# EAGLE schematic Gelijkrichter (EAGLE 9.2.0)
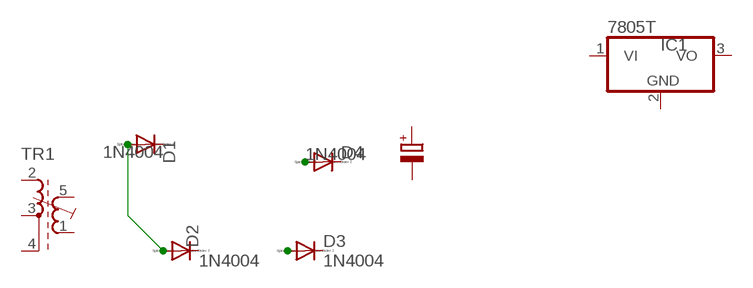
[diagram p0: schematic, sheet 1]

## Parts
D1  1N4004  [DO41-10]
D2  1N4004  [DO41-10]
D3  1N4004  [DO41-10]
D4  1N4004  [DO41-10]
IC1  7805T  [TO220H]
TR1  71-24513-2  [71-5]

## Nets
N$1: D1.A D2.A
N$3: D3.A
N$4: D4.A
Unconnected: D1.C D2.C D3.C D4.C IC1.1(VI) IC1.2(GND) IC1.3(VO) TR1.1(E2) TR1.2(A1) TR1.3(Z) TR1.4(E1) TR1.5(A2) TR1.S1 TR1.S2

## Library data of the parts
D1-D4 = diode:1N4004: DIODE general purpose rectifier, 1 A
IC1 = linear:78*: Positive VOLTAGE REGULATOR Source: http://cache.national.com/ds/LM/LM78L05.pdf http://www.fairchildsemi.com/ds/LM/LM7805.pdf
TR1 = inductor-neosid:71-: RF TRANSFORMER adjustable RF coil/transformer; OC_FARNELL: unknown; OC_NEWARK: unknown